# Altium project STB_LightBoard.PrjPcb (part 7 of 10)

## Sheet LED_Driver_NF2W757GT-F1.SchDoc: STB Light Board - 5000K
size A3; Author: mayerph; DrawnBy: mayerph; Organization: PBL; Revision: A; SheetNumber: 7; SheetTotal: 20
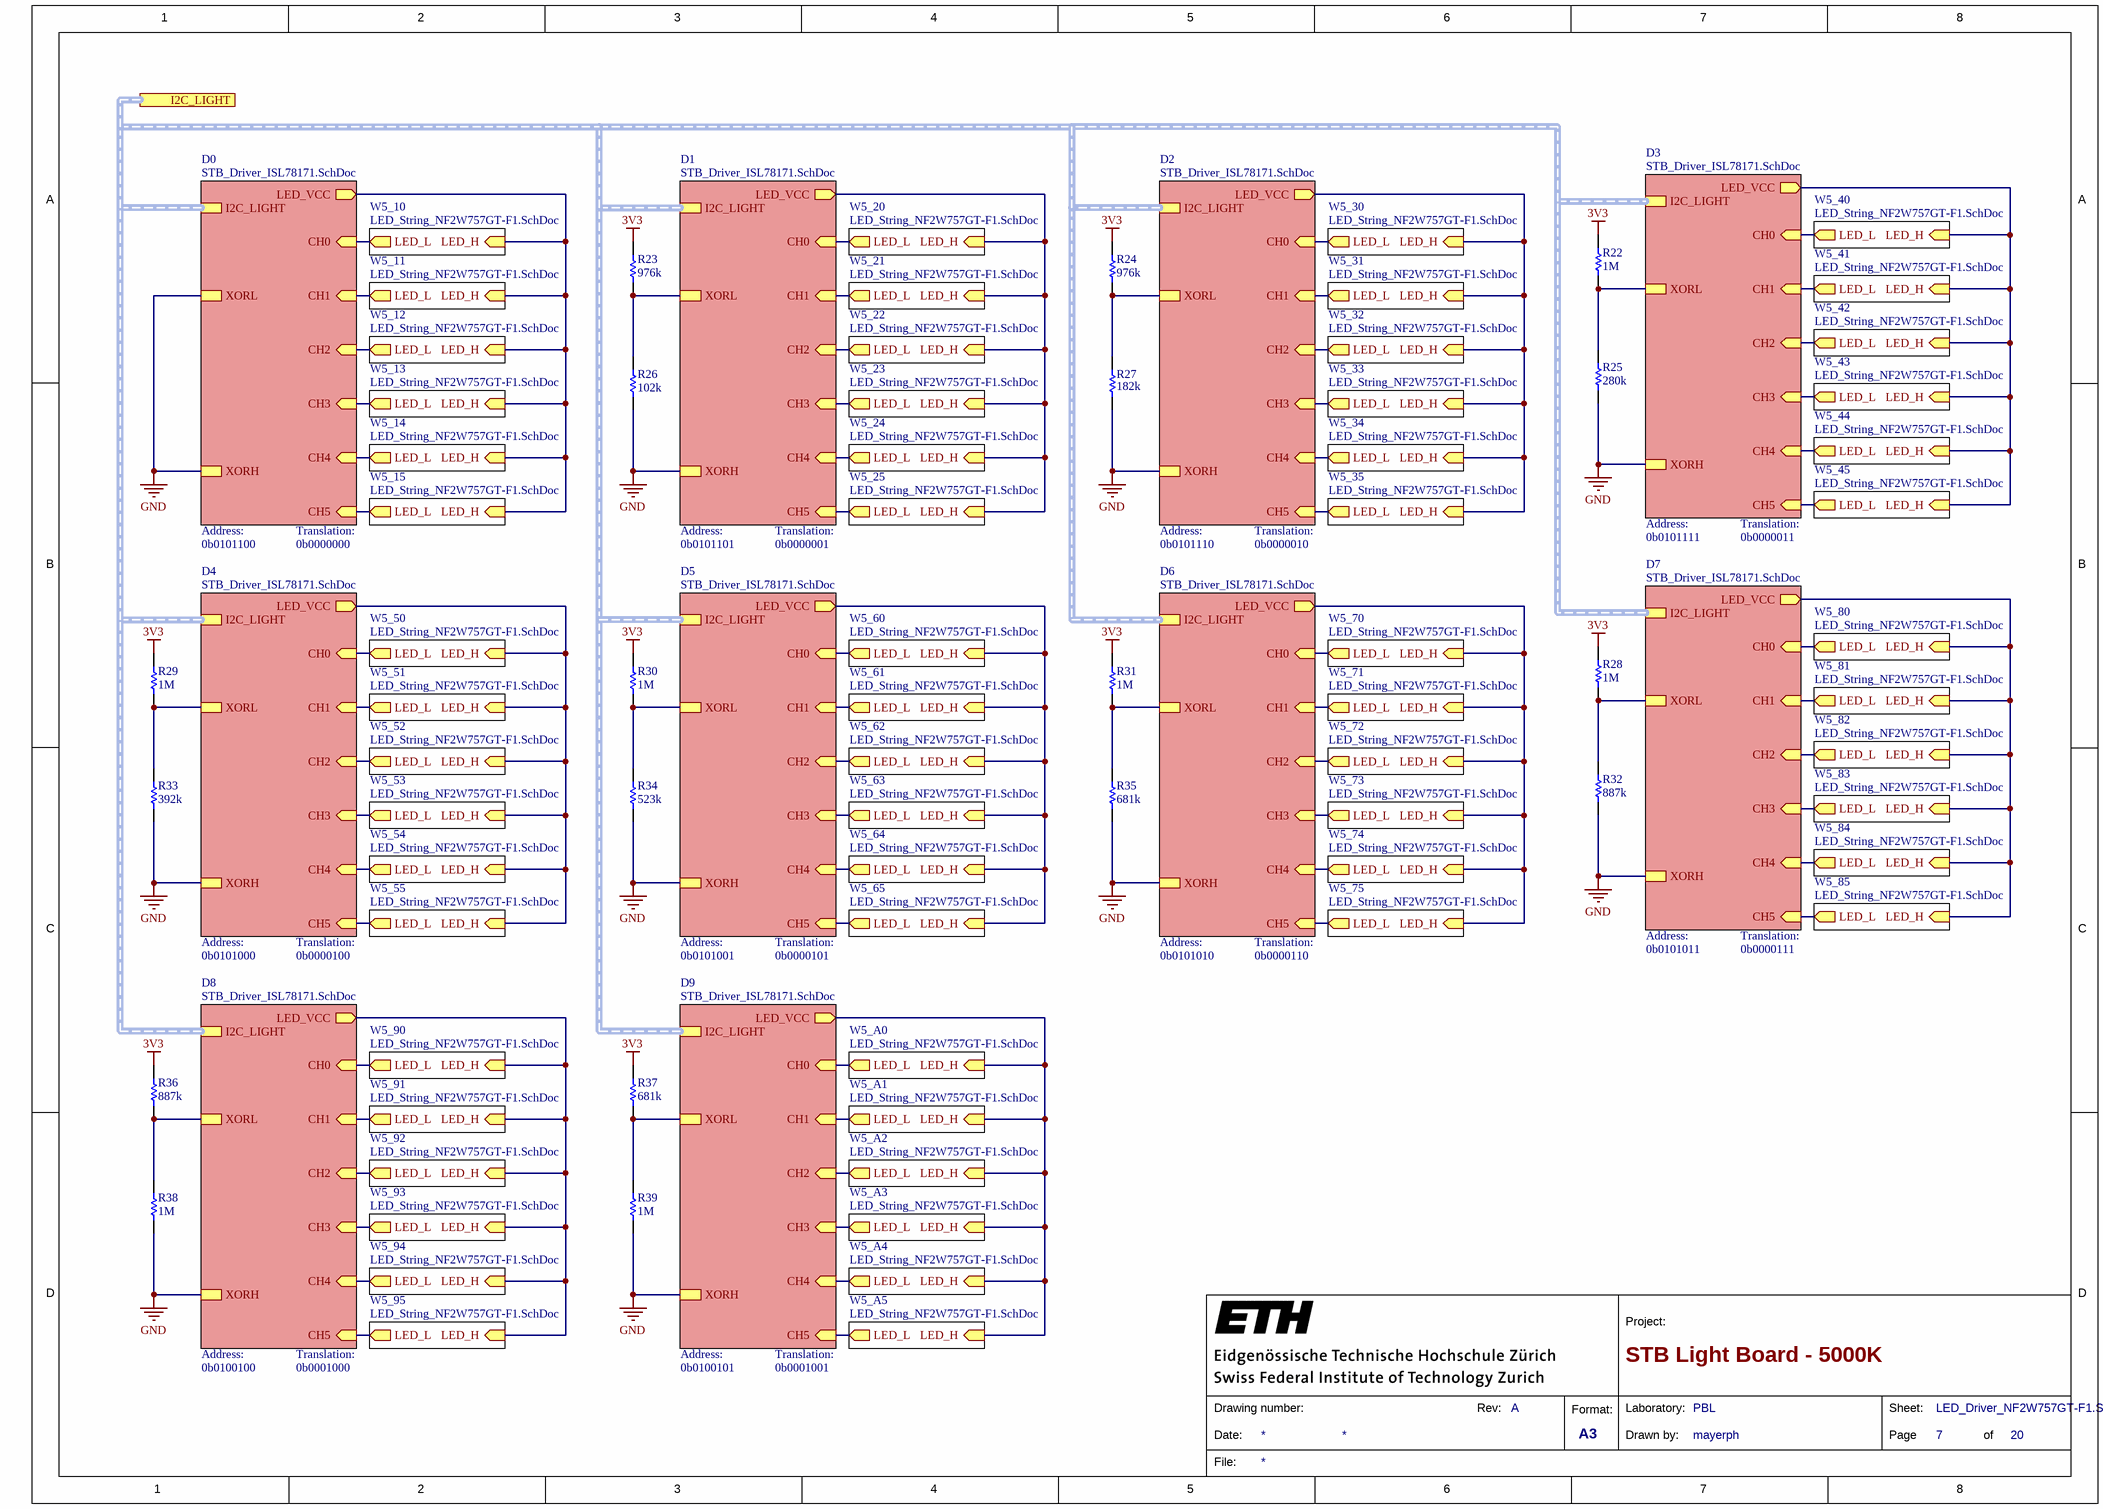
[diagram p14: LED_Driver_NF2W757GT-F1.SchDoc]

### Parts
R22  1M  [RESC1005X40X25LL05T05]
R23  976k  [RESC1005X40X25LL05T05]
R24  976k  [RESC1005X40X25LL05T05]
R25  280k  [RESC1005X40X25LL05T05]
R26  102k  [RESC1005X40X25LL05T05]
R27  182k  [RESC1005X40X25LL05T05]
R28  1M  [RESC1005X40X25LL05T05]
R29  1M  [RESC1005X40X25LL05T05]
R30  1M  [RESC1005X40X25LL05T05]
R31  1M  [RESC1005X40X25LL05T05]
R32  887k  [RESC1005X40X25LL05T10]
R33  392k  [RESC1005X40X25LL05T05]
R34  523k  [RESC1005X40X25LL05T05]
R35  681k  [RESC1005X40X25LL05T05]
R36  887k  [RESC1005X40X25LL05T10]
R37  681k  [RESC1005X40X25LL05T05]
R38  1M  [RESC1005X40X25LL05T05]
R39  1M  [RESC1005X40X25LL05T05]

### Sub-sheets
D0 = STB_Driver_ISL78171.SchDoc: CH0 (in), XORL, XORH, LED_VCC (out), CH1 (in), CH2 (in), CH3 (in), CH4 (in), CH5 (in), I2C_LIGHT (harness I2C_LIGHT)
D1 = STB_Driver_ISL78171.SchDoc: CH0 (in), XORL, XORH, LED_VCC (out), CH1 (in), CH2 (in), CH3 (in), CH4 (in), CH5 (in), I2C_LIGHT (harness I2C_LIGHT)
D2 = STB_Driver_ISL78171.SchDoc: CH0 (in), XORL, XORH, LED_VCC (out), CH1 (in), CH2 (in), CH3 (in), CH4 (in), CH5 (in), I2C_LIGHT (harness I2C_LIGHT)
D3 = STB_Driver_ISL78171.SchDoc: CH0 (in), XORL, XORH, LED_VCC (out), CH1 (in), CH2 (in), CH3 (in), CH4 (in), CH5 (in), I2C_LIGHT (harness I2C_LIGHT)
D4 = STB_Driver_ISL78171.SchDoc: CH0 (in), XORL, XORH, LED_VCC (out), CH1 (in), CH2 (in), CH3 (in), CH4 (in), CH5 (in), I2C_LIGHT (harness I2C_LIGHT)
D5 = STB_Driver_ISL78171.SchDoc: CH0 (in), XORL, XORH, LED_VCC (out), CH1 (in), CH2 (in), CH3 (in), CH4 (in), CH5 (in), I2C_LIGHT (harness I2C_LIGHT)
D6 = STB_Driver_ISL78171.SchDoc: CH0 (in), XORL, XORH, LED_VCC (out), CH1 (in), CH2 (in), CH3 (in), CH4 (in), CH5 (in), I2C_LIGHT (harness I2C_LIGHT)
D7 = STB_Driver_ISL78171.SchDoc: CH0 (in), XORL, XORH, LED_VCC (out), CH1 (in), CH2 (in), CH3 (in), CH4 (in), CH5 (in), I2C_LIGHT (harness I2C_LIGHT)
D8 = STB_Driver_ISL78171.SchDoc: CH0 (in), XORL, XORH, LED_VCC (out), CH1 (in), CH2 (in), CH3 (in), CH4 (in), CH5 (in), I2C_LIGHT (harness I2C_LIGHT)
D9 = STB_Driver_ISL78171.SchDoc: CH0 (in), XORL, XORH, LED_VCC (out), CH1 (in), CH2 (in), CH3 (in), CH4 (in), CH5 (in), I2C_LIGHT (harness I2C_LIGHT)
W5_10 = LED_String_NF2W757GT-F1.SchDoc: LED_H (in), LED_L (out)
W5_11 = LED_String_NF2W757GT-F1.SchDoc: LED_H (in), LED_L (out)
W5_12 = LED_String_NF2W757GT-F1.SchDoc: LED_H (in), LED_L (out)
W5_13 = LED_String_NF2W757GT-F1.SchDoc: LED_H (in), LED_L (out)
W5_14 = LED_String_NF2W757GT-F1.SchDoc: LED_H (in), LED_L (out)
W5_15 = LED_String_NF2W757GT-F1.SchDoc: LED_H (in), LED_L (out)
W5_20 = LED_String_NF2W757GT-F1.SchDoc: LED_H (in), LED_L (out)
W5_21 = LED_String_NF2W757GT-F1.SchDoc: LED_H (in), LED_L (out)
W5_22 = LED_String_NF2W757GT-F1.SchDoc: LED_H (in), LED_L (out)
W5_23 = LED_String_NF2W757GT-F1.SchDoc: LED_H (in), LED_L (out)
W5_24 = LED_String_NF2W757GT-F1.SchDoc: LED_H (in), LED_L (out)
W5_25 = LED_String_NF2W757GT-F1.SchDoc: LED_H (in), LED_L (out)
W5_30 = LED_String_NF2W757GT-F1.SchDoc: LED_H (in), LED_L (out)
W5_31 = LED_String_NF2W757GT-F1.SchDoc: LED_H (in), LED_L (out)
W5_32 = LED_String_NF2W757GT-F1.SchDoc: LED_H (in), LED_L (out)
W5_33 = LED_String_NF2W757GT-F1.SchDoc: LED_H (in), LED_L (out)
W5_34 = LED_String_NF2W757GT-F1.SchDoc: LED_H (in), LED_L (out)
W5_35 = LED_String_NF2W757GT-F1.SchDoc: LED_H (in), LED_L (out)
W5_40 = LED_String_NF2W757GT-F1.SchDoc: LED_H (in), LED_L (out)
W5_41 = LED_String_NF2W757GT-F1.SchDoc: LED_H (in), LED_L (out)
W5_42 = LED_String_NF2W757GT-F1.SchDoc: LED_H (in), LED_L (out)
W5_43 = LED_String_NF2W757GT-F1.SchDoc: LED_H (in), LED_L (out)
W5_44 = LED_String_NF2W757GT-F1.SchDoc: LED_H (in), LED_L (out)
W5_45 = LED_String_NF2W757GT-F1.SchDoc: LED_H (in), LED_L (out)
W5_50 = LED_String_NF2W757GT-F1.SchDoc: LED_H (in), LED_L (out)
W5_51 = LED_String_NF2W757GT-F1.SchDoc: LED_H (in), LED_L (out)
W5_52 = LED_String_NF2W757GT-F1.SchDoc: LED_H (in), LED_L (out)
W5_53 = LED_String_NF2W757GT-F1.SchDoc: LED_H (in), LED_L (out)
W5_54 = LED_String_NF2W757GT-F1.SchDoc: LED_H (in), LED_L (out)
W5_55 = LED_String_NF2W757GT-F1.SchDoc: LED_H (in), LED_L (out)
W5_60 = LED_String_NF2W757GT-F1.SchDoc: LED_H (in), LED_L (out)
W5_61 = LED_String_NF2W757GT-F1.SchDoc: LED_H (in), LED_L (out)
W5_62 = LED_String_NF2W757GT-F1.SchDoc: LED_H (in), LED_L (out)
W5_63 = LED_String_NF2W757GT-F1.SchDoc: LED_H (in), LED_L (out)
W5_64 = LED_String_NF2W757GT-F1.SchDoc: LED_H (in), LED_L (out)
W5_65 = LED_String_NF2W757GT-F1.SchDoc: LED_H (in), LED_L (out)
W5_70 = LED_String_NF2W757GT-F1.SchDoc: LED_H (in), LED_L (out)
W5_71 = LED_String_NF2W757GT-F1.SchDoc: LED_H (in), LED_L (out)
W5_72 = LED_String_NF2W757GT-F1.SchDoc: LED_H (in), LED_L (out)
W5_73 = LED_String_NF2W757GT-F1.SchDoc: LED_H (in), LED_L (out)
W5_74 = LED_String_NF2W757GT-F1.SchDoc: LED_H (in), LED_L (out)
W5_75 = LED_String_NF2W757GT-F1.SchDoc: LED_H (in), LED_L (out)
W5_80 = LED_String_NF2W757GT-F1.SchDoc: LED_H (in), LED_L (out)
W5_81 = LED_String_NF2W757GT-F1.SchDoc: LED_H (in), LED_L (out)
W5_82 = LED_String_NF2W757GT-F1.SchDoc: LED_H (in), LED_L (out)
W5_83 = LED_String_NF2W757GT-F1.SchDoc: LED_H (in), LED_L (out)
W5_84 = LED_String_NF2W757GT-F1.SchDoc: LED_H (in), LED_L (out)
W5_85 = LED_String_NF2W757GT-F1.SchDoc: LED_H (in), LED_L (out)
W5_90 = LED_String_NF2W757GT-F1.SchDoc: LED_H (in), LED_L (out)
W5_91 = LED_String_NF2W757GT-F1.SchDoc: LED_H (in), LED_L (out)
W5_92 = LED_String_NF2W757GT-F1.SchDoc: LED_H (in), LED_L (out)
W5_93 = LED_String_NF2W757GT-F1.SchDoc: LED_H (in), LED_L (out)
W5_94 = LED_String_NF2W757GT-F1.SchDoc: LED_H (in), LED_L (out)
W5_95 = LED_String_NF2W757GT-F1.SchDoc: LED_H (in), LED_L (out)
W5_A0 = LED_String_NF2W757GT-F1.SchDoc: LED_H (in), LED_L (out)
W5_A1 = LED_String_NF2W757GT-F1.SchDoc: LED_H (in), LED_L (out)
W5_A2 = LED_String_NF2W757GT-F1.SchDoc: LED_H (in), LED_L (out)
W5_A3 = LED_String_NF2W757GT-F1.SchDoc: LED_H (in), LED_L (out)
W5_A4 = LED_String_NF2W757GT-F1.SchDoc: LED_H (in), LED_L (out)
W5_A5 = LED_String_NF2W757GT-F1.SchDoc: LED_H (in), LED_L (out)

### Ports
I2C_LIGHT (harness I2C_LIGHT, see STB_LightBoard[3C], LED_Driver_AREM-80C0[1A], LED_Driver_AREM-90C0[1A], LED_Driver_NE2B757GT[2B], LED_Driver_NE2G757GT[2B], LED_Driver_NE2R757GT-P6[2B], LED_Driver_NF2L757GT-F1[1A], LED_Driver_QBHP686[1A], STB_Driver_ISL78171[1A], STB_FanControl[1A], STB_UID[1A])

### Nets
3V3: R22.2 R23.2 R24.2 R28.2 R29.2 R30.2 R31.2 R36.2 R37.2
GND: R25.1 R26.1 R27.1 R32.1 R33.1 R34.1 R35.1 R38.1 R39.1 ; sheet D0/XORL, sheet D0/XORH, sheet D1/XORH, sheet D2/XORH, sheet D3/XORH, sheet D5/XORH, sheet D6/XORH, sheet D7/XORH, sheet D4/XORH, sheet D9/XORH, sheet D8/XORH
NetC7_D0_2: sheet D0/LED_VCC, sheet W5_10/LED_H, sheet W5_11/LED_H, sheet W5_12/LED_H, sheet W5_13/LED_H, sheet W5_14/LED_H, sheet W5_15/LED_H
NetC7_D1_2: sheet D1/LED_VCC, sheet W5_20/LED_H, sheet W5_21/LED_H, sheet W5_22/LED_H, sheet W5_23/LED_H, sheet W5_24/LED_H, sheet W5_25/LED_H
NetC7_D2_2: sheet D2/LED_VCC, sheet W5_30/LED_H, sheet W5_31/LED_H, sheet W5_32/LED_H, sheet W5_33/LED_H, sheet W5_34/LED_H, sheet W5_35/LED_H
NetC7_D3_2: sheet D3/LED_VCC, sheet W5_40/LED_H, sheet W5_41/LED_H, sheet W5_42/LED_H, sheet W5_43/LED_H, sheet W5_44/LED_H, sheet W5_45/LED_H
NetC7_D4_2: sheet D4/LED_VCC, sheet W5_50/LED_H, sheet W5_51/LED_H, sheet W5_52/LED_H, sheet W5_53/LED_H, sheet W5_54/LED_H, sheet W5_55/LED_H
NetC7_D5_2: sheet D5/LED_VCC, sheet W5_60/LED_H, sheet W5_61/LED_H, sheet W5_62/LED_H, sheet W5_63/LED_H, sheet W5_64/LED_H, sheet W5_65/LED_H
NetC7_D6_2: sheet D6/LED_VCC, sheet W5_70/LED_H, sheet W5_71/LED_H, sheet W5_72/LED_H, sheet W5_73/LED_H, sheet W5_74/LED_H, sheet W5_75/LED_H
NetC7_D7_2: sheet D7/LED_VCC, sheet W5_80/LED_H, sheet W5_81/LED_H, sheet W5_82/LED_H, sheet W5_83/LED_H, sheet W5_84/LED_H, sheet W5_85/LED_H
NetC7_D8_2: sheet D8/LED_VCC, sheet W5_90/LED_H, sheet W5_91/LED_H, sheet W5_92/LED_H, sheet W5_93/LED_H, sheet W5_94/LED_H, sheet W5_95/LED_H
NetC7_D9_2: sheet D9/LED_VCC, sheet W5_A0/LED_H, sheet W5_A1/LED_H, sheet W5_A2/LED_H, sheet W5_A3/LED_H, sheet W5_A4/LED_H, sheet W5_A5/LED_H
NetLED77_W5_10_1: sheet D0/CH0, sheet W5_10/LED_L
NetLED77_W5_11_1: sheet D0/CH1, sheet W5_11/LED_L
NetLED77_W5_12_1: sheet D0/CH2, sheet W5_12/LED_L
NetLED77_W5_13_1: sheet D0/CH3, sheet W5_13/LED_L
NetLED77_W5_14_1: sheet D0/CH4, sheet W5_14/LED_L
NetLED77_W5_15_1: sheet D0/CH5, sheet W5_15/LED_L
NetLED77_W5_20_1: sheet D1/CH0, sheet W5_20/LED_L
NetLED77_W5_21_1: sheet D1/CH1, sheet W5_21/LED_L
NetLED77_W5_22_1: sheet D1/CH2, sheet W5_22/LED_L
NetLED77_W5_23_1: sheet D1/CH3, sheet W5_23/LED_L
NetLED77_W5_24_1: sheet D1/CH4, sheet W5_24/LED_L
NetLED77_W5_25_1: sheet D1/CH5, sheet W5_25/LED_L
NetLED77_W5_30_1: sheet D2/CH0, sheet W5_30/LED_L
NetLED77_W5_31_1: sheet D2/CH1, sheet W5_31/LED_L
NetLED77_W5_32_1: sheet D2/CH2, sheet W5_32/LED_L
NetLED77_W5_33_1: sheet D2/CH3, sheet W5_33/LED_L
NetLED77_W5_34_1: sheet D2/CH4, sheet W5_34/LED_L
NetLED77_W5_35_1: sheet D2/CH5, sheet W5_35/LED_L
NetLED77_W5_40_1: sheet D3/CH0, sheet W5_40/LED_L
NetLED77_W5_41_1: sheet D3/CH1, sheet W5_41/LED_L
NetLED77_W5_42_1: sheet D3/CH2, sheet W5_42/LED_L
NetLED77_W5_43_1: sheet D3/CH3, sheet W5_43/LED_L
NetLED77_W5_44_1: sheet D3/CH4, sheet W5_44/LED_L
NetLED77_W5_45_1: sheet D3/CH5, sheet W5_45/LED_L
NetLED77_W5_50_1: sheet D4/CH0, sheet W5_50/LED_L
NetLED77_W5_51_1: sheet D4/CH1, sheet W5_51/LED_L
NetLED77_W5_52_1: sheet D4/CH2, sheet W5_52/LED_L
NetLED77_W5_53_1: sheet D4/CH3, sheet W5_53/LED_L
NetLED77_W5_54_1: sheet D4/CH4, sheet W5_54/LED_L
NetLED77_W5_55_1: sheet D4/CH5, sheet W5_55/LED_L
NetLED77_W5_60_1: sheet D5/CH0, sheet W5_60/LED_L
NetLED77_W5_61_1: sheet D5/CH1, sheet W5_61/LED_L
NetLED77_W5_62_1: sheet D5/CH2, sheet W5_62/LED_L
NetLED77_W5_63_1: sheet D5/CH3, sheet W5_63/LED_L
NetLED77_W5_64_1: sheet D5/CH4, sheet W5_64/LED_L
NetLED77_W5_65_1: sheet D5/CH5, sheet W5_65/LED_L
NetLED77_W5_70_1: sheet D6/CH0, sheet W5_70/LED_L
NetLED77_W5_71_1: sheet D6/CH1, sheet W5_71/LED_L
NetLED77_W5_72_1: sheet D6/CH2, sheet W5_72/LED_L
NetLED77_W5_73_1: sheet D6/CH3, sheet W5_73/LED_L
NetLED77_W5_74_1: sheet D6/CH4, sheet W5_74/LED_L
NetLED77_W5_75_1: sheet D6/CH5, sheet W5_75/LED_L
NetLED77_W5_80_1: sheet D7/CH0, sheet W5_80/LED_L
NetLED77_W5_81_1: sheet D7/CH1, sheet W5_81/LED_L
NetLED77_W5_82_1: sheet D7/CH2, sheet W5_82/LED_L
NetLED77_W5_83_1: sheet D7/CH3, sheet W5_83/LED_L
NetLED77_W5_84_1: sheet D7/CH4, sheet W5_84/LED_L
NetLED77_W5_85_1: sheet D7/CH5, sheet W5_85/LED_L
NetLED77_W5_90_1: sheet D8/CH0, sheet W5_90/LED_L
NetLED77_W5_91_1: sheet D8/CH1, sheet W5_91/LED_L
NetLED77_W5_92_1: sheet D8/CH2, sheet W5_92/LED_L
NetLED77_W5_93_1: sheet D8/CH3, sheet W5_93/LED_L
NetLED77_W5_94_1: sheet D8/CH4, sheet W5_94/LED_L
NetLED77_W5_95_1: sheet D8/CH5, sheet W5_95/LED_L
NetLED77_W5_A0_1: sheet D9/CH0, sheet W5_A0/LED_L
NetLED77_W5_A1_1: sheet D9/CH1, sheet W5_A1/LED_L
NetLED77_W5_A2_1: sheet D9/CH2, sheet W5_A2/LED_L
NetLED77_W5_A3_1: sheet D9/CH3, sheet W5_A3/LED_L
NetLED77_W5_A4_1: sheet D9/CH4, sheet W5_A4/LED_L
NetLED77_W5_A5_1: sheet D9/CH5, sheet W5_A5/LED_L
NetR22_1: R22.1 R25.2 ; sheet D3/XORL
NetR23_1: R23.1 R26.2 ; sheet D1/XORL
NetR24_1: R24.1 R27.2 ; sheet D2/XORL
NetR28_1: R28.1 R32.2 ; sheet D7/XORL
NetR29_1: R29.1 R33.2 ; sheet D4/XORL
NetR30_1: R30.1 R34.2 ; sheet D5/XORL
NetR31_1: R31.1 R35.2 ; sheet D6/XORL
NetR36_1: R36.1 R38.2 ; sheet D8/XORL
NetR37_1: R37.1 R39.2 ; sheet D9/XORL

### Buses and harness runs
harness port I2C_LIGHT = sheet D0/I2C_LIGHT = sheet D1/I2C_LIGHT = sheet D2/I2C_LIGHT = sheet D3/I2C_LIGHT = sheet D4/I2C_LIGHT = sheet D5/I2C_LIGHT = sheet D6/I2C_LIGHT = sheet D7/I2C_LIGHT = sheet D8/I2C_LIGHT = sheet D9/I2C_LIGHT

### Notes on the sheet
- 0b0101100
- Address:
- 0b0000000
- Translation:
- 0b0101101
- 0b0000001
- 0b0101110
- 0b0000010
- 0b0101111
- 0b0000011
- 0b0101000
- 0b0000100
- 0b0101001
- 0b0000101
- 0b0101010
- 0b0000110
- 0b0101011
- 0b0000111
- 0b0100100
- 0b0001000
- 0b0100101
- 0b0001001
- 1
- 2
- 3
- 4
- 5
- 6
- 7
- 8
- A
- B
- C
- D
- Project:
- Date:
- Drawing number:
- Rev:
- Format:
- A3
- Drawn by:
- Laboratory:
- Page
- Sheet:
- of
- File:

### Library data of the parts
R22 R28-R31 R38 R39 = CMP-2002-00609-3: Chip Resistor, 1 MOhm, +/- 1%, 100 mW, -55 to 155 degC, 0402 (1005 Metric), RoHS, Tape and Reel; PartNumber: ERJ-2RKF1004X; Manufacturer: Basic Passives; Voltage Rating: 50 V; Case\/Package: 0402; Value: 1 MOhm; Power Rating: 100 mW; Rated Power Dissipation (P): 100mW; Temperature Coefficient: 100ppm/°C; Working Voltage: 50V; Rated Temperature: 70°C; Package Height: 0.35mm; Package Length: 1mm; Package Width: 0.5mm; Reference Standard: AEC-Q200; Pins: 2; Max Operating Temperature: 155 degC; ComponentLink2URL: http://industrial.panasonic.com/cdbs/www-data/pdf/RDA0000/AOA0000C86.pdf; Weight: 2.8E-05oz; ComponentLink1URL: http://www.panasonic.com/; Radiation Hardening: No; Height: 0.35 mm; Case Code (Imperial): 0402; ComponentLink2Description: Datasheet; Mount: Surface Mount; ComponentLink1Description: Manufacturer URL; REACH SVHC: Yes; Length: 1 mm; Min Operating Temperature: -55 degC; Width: 0.5 mm; Package Quantity: 10000; Tolerance: 1%; PackageDescription: 2-Pin Surface Mount Device, Body 1 x 0.5 mm; RoHSCompliant: true; DatasheetVersion: 04/2015; PackageReference: 0402; Mounting Technology: Surface Mount; Case Code (Metric): 1005; Packaging: Tape and Reel; Supplier 1: Digi-Key; Supplier Part Number 1: P1.00MLDKR-ND; Manufacturer Part Number: ERJ-2RKF1004X; RoHS: Yes; Category: Chip SMD Resistors; Stock 1: 1012879; Pricing 1: 1=0.10000, 10=0.03300, 100=0.01330, 1000=0.00599, 2500=0.00520, 5000=0.00429 (USD); Number of Pins: 2; Package Shape: Rectangular; Size Code: 0402; Terminal Finish: Nickel; JESD-609 Code: e3; Resistor Type: FIXED RESISTOR; Construction: Rectangular; Package Style: SMTMeter; Technology: METAL GLAZE/THICK FILM; Termination: Wraparound; Reach SVHC Compliant: Yes; RoHS Compliant: Yes; ComponentLink3URL: https://datasheet.ciiva.com:443/pdfs/VipMasterIC/IC/PANA/PANA-S-A0009889626/PANA-S-A0009889626-1.pdf?src-supplier=IHS+Markit; ComponentLink3Description: https://datasheet.ciiva.com:443/pdfs/VipMasterIC/IC/PANA/PANA-S-A0009889626/PANA-S-A0009889626-1.pdf?src-supplier=IHS+Markit; ComponentLink4URL: https://datasheet.ciiva.com/34303/1987046-34303551.pdf?src-supplier=Jameco; ComponentLink4Description: https://datasheet.ciiva.com/34303/1987046-34303551.pdf?src-supplier=Jameco; ComponentLink5URL: https://datasheet.ciiva.com/11821/0900766b80f80784-11821229.pdf?src-supplier=RSComponents; ComponentLink5Description: https://datasheet.ciiva.com/11821/0900766b80f80784-11821229.pdf?src-supplier=RSComponents; ComponentLink6URL: https://datasheet.ciiva.com/7909/aoa0000ce2-7909180.pdf?src-supplier=Element14; ComponentLink6Description: https://datasheet.ciiva.com/7909/aoa0000ce2-7909180.pdf?src-supplier=Element14; ComponentLink7URL: https://datasheet.ciiva.com/22723/1678782-22723164.pdf?src-supplier=Element14; ComponentLink7Description: https://datasheet.ciiva.com/22723/1678782-22723164.pdf?src-supplier=Element14; ComponentLink8URL: https://datasheet.ciiva.com/24158/aoa0000ce2-24158990.pdf?src-supplier=Mouser; ComponentLink8Description: https://datasheet.ciiva.com/24158/aoa0000ce2-24158990.pdf?src-supplier=Mouser; ComponentLink9URL: https://datasheet.ciiva.com/16766/70260748-16766711.pdf?src-supplier=Allied+Electronics; ComponentLink9Description: https://datasheet.ciiva.com/16766/70260748-16766711.pdf?src-supplier=Allied+Electronics; ComponentLink10URL: https://datasheet.ciiva.com/16779/70260748-16779288.pdf?src-supplier=Allied+Electronics; ComponentLink10Description: https://datasheet.ciiva.com/16779/70260748-16779288.pdf?src-supplier=Allied+Electronics; ComponentLink11URL: https://datasheet.ciiva.com/16199/aoa0000ce2-16199544.pdf?src-supplier=Future+Electronics; ComponentLink11Description: https://datasheet.ciiva.com/16199/aoa0000ce2-16199544.pdf?src-supplier=Future+Electronics
R23 R24 = CMP-2002-01120-1: Manufacturer: Panasonic; Part Number: ERJ-2RKF9763X; Tolerance: 1%; Rated Power Dissipation (P): 100mW; Rated Temperature: 70°C; Value: 976 kOhm; Temperature Coefficient: 100ppm/°C; Working Voltage: 50V; Package Height: 0.35mm; Package Length: 1mm; Package Width: 0.5mm; Reference Standard: AEC-Q200; Supplier 1: Digi-Key; Supplier Part Number 1: P976KLCT-ND; Manufacturer Part Number: ERJ-2RKF9763X; RoHS: Yes; Category: Chip SMD Resistors; Stock 1: 136638; Pricing 1: 1=0.10000, 10=0.03300, 100=0.01330, 1000=0.00599, 2500=0.00520, 5000=0.00429 (USD); Mount: Surface Mount; Number of Pins: 2; Size Code: 0402; Terminal Finish: Nickel; Package Shape: Rectangular; Min Operating Temperature: -55°C; Max Operating Temperature: 155°C; Resistor Type: FIXED RESISTOR; Construction: Rectangular; Package Style: SMTMeter; Packaging: Tape and Reel; Termination: Wraparound; JESD-609 Code: e3; Technology: METAL GLAZE/THICK FILM; Reach SVHC Compliant: Yes; RoHS Compliant: Yes; ComponentLink1URL: https://datasheet.ciiva.com:443/pdfs/VipMasterIC/IC/PANA/PANA-S-A0009889626/PANA-S-A0009889626-1.pdf?src-supplier=IHS+Markit; ComponentLink1Description: https://datasheet.ciiva.com:443/pdfs/VipMasterIC/IC/PANA/PANA-S-A0009889626/PANA-S-A0009889626-1.pdf?src-supplier=IHS+Markit; ComponentLink2URL: https://datasheet.ciiva.com/43467/1678782-43467581.pdf?src-supplier=Farnell; ComponentLink2Description: https://datasheet.ciiva.com/43467/1678782-43467581.pdf?src-supplier=Farnell; ComponentLink3URL: https://datasheet.ciiva.com/46372/1678782-46372911.pdf?src-supplier=Element14; ComponentLink3Description: https://datasheet.ciiva.com/46372/1678782-46372911.pdf?src-supplier=Element14; ComponentLink4URL: https://datasheet.ciiva.com/22668/1678782-22668415.pdf?src-supplier=Element14; ComponentLink4Description: https://datasheet.ciiva.com/22668/1678782-22668415.pdf?src-supplier=Element14; ComponentLink5URL: https://datasheet.ciiva.com/16758/70260748-16758903.pdf?src-supplier=Allied+Electronics; ComponentLink5Description: https://datasheet.ciiva.com/16758/70260748-16758903.pdf?src-supplier=Allied+Electronics; ComponentLink6URL: https://datasheet.ciiva.com/9179/aoa0000ce2-9179357.pdf?src-supplier=Avnet; ComponentLink6Description: https://datasheet.ciiva.com/9179/aoa0000ce2-9179357.pdf?src-supplier=Avnet; ComponentLink7URL: https://datasheet.ciiva.com/30176/aoa0000ce2-30176831.pdf?src-supplier=Onlinecomponents.com; ComponentLink7Description: https://datasheet.ciiva.com/30176/aoa0000ce2-30176831.pdf?src-supplier=Onlinecomponents.com
R25 = CMP-1011-00785-4: Chip Resistor, 280 KOhm, +/- 1%, 100 mW, -55 to 155 degC, 0402 (1005 Metric), RoHS, Cut Tape; PartNumber: ERJ-2RKF2803X; Manufacturer: Basic Passives; Power Rating: 100 mW; Case\/Package: 0402; Voltage Rating: 50 V; Rated Power Dissipation (P): 100mW; Rated Temperature: 70°C; Temperature Coefficient: 100ppm/°C; Working Voltage: 50V; Package Height: 0.35mm; Package Length: 1mm; Package Width: 0.5mm; Reference Standard: AEC-Q200; Value: 280 kOhm; Width: 0.02 inch; Packaging: Cut Tape; Min Operating Temperature: -55 degC; Package Quantity: 10000; Height: 0.016 inch; ComponentLink2Description: Datasheet; REACH SVHC: Yes; Length: 0.039 inch; Mounting Technology: Surface Mount; Mount: Surface Mount; ComponentLink1Description: Manufacturer URL; PackageDescription: 2-Pin Surface Mount Device, Body 1 x 0.5 mm; PackageReference: 0402; Case Code (Metric): 1005; ComponentLink2URL: http://industrial.panasonic.com/cdbs/www-data/pdf/RDA0000/AOA0000C86.pdf; Pins: 2; DatasheetVersion: 04/2015; ComponentLink1URL: http://www.panasonic.com/; RoHSCompliant: true; Case Code (Imperial): 0402; Tolerance: 1%; Max Operating Temperature: 155 degC; Supplier 1: Digi-Key; Supplier Part Number 1: P280KLDKR-ND; Manufacturer Part Number: ERJ-2RKF2803X; RoHS: Yes; Category: Chip SMD Resistors; Stock 1: 156859; Pricing 1: 1=0.10000, 10=0.03300, 100=0.01330, 1000=0.00599, 2500=0.00520, 5000=0.00429 (USD); Number of Pins: 2; Size Code: 0402; Terminal Finish: Nickel; Package Shape: Rectangular; Resistor Type: FIXED RESISTOR; Termination: Wraparound; JESD-609 Code: e3; Construction: Rectangular; Package Style: SMTMeter; Technology: METAL GLAZE/THICK FILM; Reach SVHC Compliant: Yes; RoHS Compliant: Yes; ComponentLink3URL: https://datasheet.ciiva.com:443/pdfs/VipMasterIC/IC/PANA/PANA-S-A0009889626/PANA-S-A0009889626-1.pdf?src-supplier=IHS+Markit; ComponentLink3Description: https://datasheet.ciiva.com:443/pdfs/VipMasterIC/IC/PANA/PANA-S-A0009889626/PANA-S-A0009889626-1.pdf?src-supplier=IHS+Markit; ComponentLink4URL: https://datasheet.ciiva.com/9183/aoa0000ce2-9183500.pdf?src-supplier=Avnet; ComponentLink4Description: https://datasheet.ciiva.com/9183/aoa0000ce2-9183500.pdf?src-supplier=Avnet; ComponentLink5URL: https://datasheet.ciiva.com/28594/1694929-28594570.pdf?src-supplier=Element14; ComponentLink5Description: https://datasheet.ciiva.com/28594/1694929-28594570.pdf?src-supplier=Element14; ComponentLink6URL: https://datasheet.ciiva.com/24024/aoa0000ce2-24024731.pdf?src-supplier=Mouser; ComponentLink6Description: https://datasheet.ciiva.com/24024/aoa0000ce2-24024731.pdf?src-supplier=Mouser; ComponentLink7URL: https://datasheet.ciiva.com/30177/aoa0000ce2-30177532.pdf?src-supplier=Onlinecomponents.com; ComponentLink7Description: https://datasheet.ciiva.com/30177/aoa0000ce2-30177532.pdf?src-supplier=Onlinecomponents.com; ComponentLink8URL: https://datasheet.ciiva.com/7712/1678782-7712815.pdf?src-supplier=Element14; ComponentLink8Description: https://datasheet.ciiva.com/7712/1678782-7712815.pdf?src-supplier=Element14
R26 = CMP-2002-00613-1: Manufacturer: Panasonic; Part Number: ERJ-2RKF1023X; Tolerance: 1%; Rated Power Dissipation (P): 100mW; Rated Temperature: 70°C; Value: 102 kOhm; Temperature Coefficient: 100ppm/°C; Working Voltage: 50V; Package Height: 0.35mm; Package Length: 1mm; Package Width: 0.5mm; Reference Standard: AEC-Q200; Supplier 1: Digi-Key; Supplier Part Number 1: P102KLDKR-ND; Manufacturer Part Number: ERJ-2RKF1023X; RoHS: Yes; Category: Chip SMD Resistors; Stock 1: 79400; Pricing 1: 1=0.10000, 10=0.03300, 100=0.01330, 1000=0.00599, 2500=0.00520, 5000=0.00429 (USD); Mount: Surface Mount; Number of Pins: 2; Size Code: 0402; Terminal Finish: Nickel; Package Shape: Rectangular; Min Operating Temperature: -55°C; Max Operating Temperature: 155°C; Resistor Type: FIXED RESISTOR; Construction: Rectangular; Package Style: SMTMeter; Packaging: Tape and Reel; Technology: METAL GLAZE/THICK FILM; Termination: Wraparound; JESD-609 Code: e3; Reach SVHC Compliant: Yes; RoHS Compliant: Yes; ComponentLink1URL: https://datasheet.ciiva.com:443/pdfs/VipMasterIC/IC/PANA/PANA-S-A0009889626/PANA-S-A0009889626-1.pdf?src-supplier=IHS+Markit; ComponentLink1Description: https://datasheet.ciiva.com:443/pdfs/VipMasterIC/IC/PANA/PANA-S-A0009889626/PANA-S-A0009889626-1.pdf?src-supplier=IHS+Markit; ComponentLink2URL: https://datasheet.ciiva.com/43467/1678782-43467481.pdf?src-supplier=Farnell; ComponentLink2Description: https://datasheet.ciiva.com/43467/1678782-43467481.pdf?src-supplier=Farnell; ComponentLink3URL: https://datasheet.ciiva.com/9119/aoa0000ce2-9119242.pdf?src-supplier=Avnet; ComponentLink3Description: https://datasheet.ciiva.com/9119/aoa0000ce2-9119242.pdf?src-supplier=Avnet; ComponentLink4URL: https://datasheet.ciiva.com/16781/70260748-16781503.pdf?src-supplier=Allied+Electronics; ComponentLink4Description: https://datasheet.ciiva.com/16781/70260748-16781503.pdf?src-supplier=Allied+Electronics; ComponentLink5URL: https://datasheet.ciiva.com/22673/1678782-22673487.pdf?src-supplier=Element14; ComponentLink5Description: https://datasheet.ciiva.com/22673/1678782-22673487.pdf?src-supplier=Element14; ComponentLink6URL: https://datasheet.ciiva.com/16763/70260748-16763080.pdf?src-supplier=Allied+Electronics; ComponentLink6Description: https://datasheet.ciiva.com/16763/70260748-16763080.pdf?src-supplier=Allied+Electronics; ComponentLink7URL: https://datasheet.ciiva.com/7712/1678782-7712798.pdf?src-supplier=Element14; ComponentLink7Description: https://datasheet.ciiva.com/7712/1678782-7712798.pdf?src-supplier=Element14; ComponentLink8URL: https://datasheet.ciiva.com/46373/1678782-46373215.pdf?src-supplier=Element14; ComponentLink8Description: https://datasheet.ciiva.com/46373/1678782-46373215.pdf?src-supplier=Element14
R27 = CMP-2002-08256-1: Manufacturer: Vishay Dale; Part Number: CRCW0402182KFKED; Value: 182 kOhm; Tolerance: 1%; Rated Power Dissipation (P): 63mW; Resistance: 182kR; Temperature Coefficient: 100ppm/°C; Working Voltage: 50V; Rated Temperature: 70°C; Package Height: 0.35mm; Package Length: 1mm; Package Width: 0.5mm; Reference Standard: AEC-Q200; Supplier 1: Digi-Key; Supplier Part Number 1: 541-182KLDKR-ND; Manufacturer Part Number: CRCW0402182KFKED; RoHS: Yes; Category: Chip SMD Resistors; Stock 1: 76709; Pricing 1: 1=0.10000, 10=0.03600, 100=0.01460, 1000=0.00656, 2500=0.00569, 5000=0.00470 (USD); Mount: Surface Mount; Number of Pins: 2; Size Code: 0402; Terminal Finish: Nickel; Package Shape: Rectangular; Min Operating Temperature: -55°C; Max Operating Temperature: 155°C; JESD-609 Code: e3; Resistor Type: FIXED RESISTOR; Construction: Chip; Package Style: SMTMeter; Packaging: Tape and Reel; Technology: METAL GLAZE/THICK FILM; Termination: Wraparound; Reach SVHC Compliant: Yes; RoHS Compliant: Yes; ComponentLink1URL: https://datasheet.ciiva.com:443/pdfs/VipMasterIC/IC/VISH/VISH-S-A0007266705/VISH-S-A0007266705-1.pdf?src-supplier=IHS+Markit; ComponentLink1Description: https://datasheet.ciiva.com:443/pdfs/VipMasterIC/IC/VISH/VISH-S-A0007266705/VISH-S-A0007266705-1.pdf?src-supplier=IHS+Markit; ComponentLink2URL: https://datasheet.ciiva.com/3256/dcrcwe3-3256117.pdf?src-supplier=Avnet; ComponentLink2Description: https://datasheet.ciiva.com/3256/dcrcwe3-3256117.pdf?src-supplier=Avnet; ComponentLink3URL: https://datasheet.ciiva.com/2463/dcrcwe3-2463286.pdf?src-supplier=Digi-Key; ComponentLink3Description: https://datasheet.ciiva.com/2463/dcrcwe3-2463286.pdf?src-supplier=Digi-Key; ComponentLink4URL: https://datasheet.ciiva.com/5545/dcrcwe3-109170-5545910.pdf?src-supplier=Mouser; ComponentLink4Description: https://datasheet.ciiva.com/5545/dcrcwe3-109170-5545910.pdf?src-supplier=Mouser; ComponentLink5URL: https://datasheet.ciiva.com/2463/dcrcwe3-2463287.pdf?src-supplier=Digi-Key; ComponentLink5Description: https://datasheet.ciiva.com/2463/dcrcwe3-2463287.pdf?src-supplier=Digi-Key; ComponentLink6URL: https://datasheet.ciiva.com/7714/1697337-7714183.pdf?src-supplier=Element14; ComponentLink6Description: https://datasheet.ciiva.com/7714/1697337-7714183.pdf?src-supplier=Element14; ComponentLink7URL: https://datasheet.ciiva.com/2463/dcrcwe3-2463288.pdf?src-supplier=Digi-Key; ComponentLink7Description: https://datasheet.ciiva.com/2463/dcrcwe3-2463288.pdf?src-supplier=Digi-Key; ComponentLink8URL: https://datasheet.ciiva.com/16785/70201119-16785993.pdf?src-supplier=Allied+Electronics; ComponentLink8Description: https://datasheet.ciiva.com/16785/70201119-16785993.pdf?src-supplier=Allied+Electronics; ComponentLink9URL: https://datasheet.ciiva.com/7714/1697337-7714365.pdf?src-supplier=Element14; ComponentLink9Description: https://datasheet.ciiva.com/7714/1697337-7714365.pdf?src-supplier=Element14
R32 R36 = CMP-2002-07827-1: Part Number: RC0402FR-07887KL; Manufacturer: Yageo / Phycomp; Tolerance: 1%; Rated Power Dissipation (P): 62.5mW; Rated Temperature: 70°C; Value: 887 kOhm; Temperature Coefficient: 100ppm/°C; Working Voltage: 50V; Additional Feature: LASER TRIMMABLE; Package Height: 0.35mm; Package Length: 1mm; Package Width: 0.5mm; Supplier 1: Digi-Key; Supplier Part Number 1: YAG3251CT-ND; Manufacturer Part Number: RC0402FR-07887KL; RoHS: Yes; Category: Chip SMD Resistors; Stock 1: 288491; Pricing 1: 1=0.10000, 10=0.01500, 100=0.00600, 1000=0.00267, 2500=0.00232, 5000=0.00192 (USD); Mount: Surface Mount; Number of Pins: 2; Size Code: 0402; Terminal Finish: Nickel; Package Shape: Rectangular; Min Operating Temperature: -55°C; Max Operating Temperature: 155°C; Resistor Type: FIXED RESISTOR; Construction: Chip; Package Style: SMTMeter; Packaging: Tape and Reel; Termination: Wraparound; JESD-609 Code: e3; Technology: METAL GLAZE/THICK FILM; Reach SVHC Compliant: Yes; RoHS Compliant: Yes; ComponentLink1URL: https://datasheet.ciiva.com:443/pdfs/VipMasterIC/IC/YAGO/YAGO-S-A0008145938/YAGO-S-A0008145938-1.pdf?src-supplier=IHS+Markit; ComponentLink1Description: https://datasheet.ciiva.com:443/pdfs/VipMasterIC/IC/YAGO/YAGO-S-A0008145938/YAGO-S-A0008145938-1.pdf?src-supplier=IHS+Markit; ComponentLink2URL: https://datasheet.ciiva.com/16744/pyu-rc0402-51-rohs-l-6-r-16744239.pdf?src-supplier=Future+Electronics; ComponentLink2Description: https://datasheet.ciiva.com/16744/pyu-rc0402-51-rohs-l-6-r-16744239.pdf?src-supplier=Future+Electronics
R33 = CMP-2002-00914-1: Part Number: ERJ-2RKF3923X; Manufacturer: Panasonic; Tolerance: 1%; Rated Power Dissipation (P): 100mW; Rated Temperature: 70°C; Value: 392 kOhm; Temperature Coefficient: 100ppm/°C; Working Voltage: 50V; Package Height: 0.35mm; Package Length: 1mm; Package Width: 0.5mm; Reference Standard: AEC-Q200; Supplier 1: Digi-Key; Supplier Part Number 1: P392KLDKR-ND; Manufacturer Part Number: ERJ-2RKF3923X; RoHS: Yes; Category: Chip SMD Resistors; Stock 1: 100496; Pricing 1: 1=0.10000, 10=0.03300, 100=0.01330, 1000=0.00599, 2500=0.00520, 5000=0.00429 (USD); Mount: Surface Mount; Number of Pins: 2; Size Code: 0402; Terminal Finish: Nickel; Package Shape: Rectangular; Min Operating Temperature: -55°C; Max Operating Temperature: 155°C; JESD-609 Code: e3; Resistor Type: FIXED RESISTOR; Construction: Rectangular; Package Style: SMTMeter; Packaging: Tape and Reel; Technology: METAL GLAZE/THICK FILM; Termination: Wraparound; Reach SVHC Compliant: Yes; RoHS Compliant: Yes; ComponentLink1URL: https://datasheet.ciiva.com:443/pdfs/VipMasterIC/IC/PANA/PANA-S-A0009889626/PANA-S-A0009889626-1.pdf?src-supplier=IHS+Markit; ComponentLink1Description: https://datasheet.ciiva.com:443/pdfs/VipMasterIC/IC/PANA/PANA-S-A0009889626/PANA-S-A0009889626-1.pdf?src-supplier=IHS+Markit; ComponentLink2URL: https://datasheet.ciiva.com/24069/aoa0000ce2-24069223.pdf?src-supplier=Mouser; ComponentLink2Description: https://datasheet.ciiva.com/24069/aoa0000ce2-24069223.pdf?src-supplier=Mouser; ComponentLink3URL: https://datasheet.ciiva.com/30085/aoa0000ce2-30085781.pdf?src-supplier=Onlinecomponents.com; ComponentLink3Description: https://datasheet.ciiva.com/30085/aoa0000ce2-30085781.pdf?src-supplier=Onlinecomponents.com; ComponentLink4URL: https://datasheet.ciiva.com/16781/70260748-16781463.pdf?src-supplier=Allied+Electronics; ComponentLink4Description: https://datasheet.ciiva.com/16781/70260748-16781463.pdf?src-supplier=Allied+Electronics; ComponentLink5URL: https://datasheet.ciiva.com/22673/1678782-22673356.pdf?src-supplier=Element14; ComponentLink5Description: https://datasheet.ciiva.com/22673/1678782-22673356.pdf?src-supplier=Element14; ComponentLink6URL: https://datasheet.ciiva.com/46399/1678782-46399980.pdf?src-supplier=Element14; ComponentLink6Description: https://datasheet.ciiva.com/46399/1678782-46399980.pdf?src-supplier=Element14; ComponentLink7URL: https://datasheet.ciiva.com/46399/1678782-46399981.pdf?src-supplier=Element14; ComponentLink7Description: https://datasheet.ciiva.com/46399/1678782-46399981.pdf?src-supplier=Element14; ComponentLink8URL: https://datasheet.ciiva.com/22776/1678782-22776542.pdf?src-supplier=Farnell; ComponentLink8Description: https://datasheet.ciiva.com/22776/1678782-22776542.pdf?src-supplier=Farnell; ComponentLink9URL: https://datasheet.ciiva.com/16774/70260748-16774815.pdf?src-supplier=Allied+Electronics; ComponentLink9Description: https://datasheet.ciiva.com/16774/70260748-16774815.pdf?src-supplier=Allied+Electronics
R34 = CMP-2002-00982-1: Manufacturer: Panasonic; Part Number: ERJ-2RKF5233X; Tolerance: 1%; Rated Power Dissipation (P): 100mW; Value: 523 kOhm; Temperature Coefficient: 100ppm/°C; Working Voltage: 50V; Rated Temperature: 70°C; Package Height: 0.35mm; Package Length: 1mm; Package Width: 0.5mm; Reference Standard: AEC-Q200; Supplier 1: Digi-Key; Supplier Part Number 1: P523KLCT-ND; Manufacturer Part Number: ERJ-2RKF5233X; RoHS: Yes; Category: Chip SMD Resistors; Stock 1: 154886; Pricing 1: 1=0.10000, 10=0.03300, 100=0.01330, 1000=0.00599, 2500=0.00520, 5000=0.00429 (USD); Mount: Surface Mount; Number of Pins: 2; Size Code: 0402; Terminal Finish: Nickel; Package Shape: Rectangular; Min Operating Temperature: -55°C; Max Operating Temperature: 155°C; JESD-609 Code: e3; Resistor Type: FIXED RESISTOR; Construction: Rectangular; Package Style: SMTMeter; Packaging: Tape and Reel; Technology: METAL GLAZE/THICK FILM; Termination: Wraparound; Reach SVHC Compliant: Yes; RoHS Compliant: Yes; ComponentLink1URL: https://datasheet.ciiva.com:443/pdfs/VipMasterIC/IC/PANA/PANA-S-A0009889626/PANA-S-A0009889626-1.pdf?src-supplier=IHS+Markit; ComponentLink1Description: https://datasheet.ciiva.com:443/pdfs/VipMasterIC/IC/PANA/PANA-S-A0009889626/PANA-S-A0009889626-1.pdf?src-supplier=IHS+Markit; ComponentLink2URL: https://datasheet.ciiva.com/30220/aoa0000ce2-30220984.pdf?src-supplier=Onlinecomponents.com; ComponentLink2Description: https://datasheet.ciiva.com/30220/aoa0000ce2-30220984.pdf?src-supplier=Onlinecomponents.com; ComponentLink3URL: https://datasheet.ciiva.com/24027/aoa0000ce2-24027141.pdf?src-supplier=Mouser; ComponentLink3Description: https://datasheet.ciiva.com/24027/aoa0000ce2-24027141.pdf?src-supplier=Mouser; ComponentLink4URL: https://datasheet.ciiva.com/9181/aoa0000ce2-9181337.pdf?src-supplier=Avnet; ComponentLink4Description: https://datasheet.ciiva.com/9181/aoa0000ce2-9181337.pdf?src-supplier=Avnet; ComponentLink5URL: https://datasheet.ciiva.com/9181/aoa0000ce2-9181340.pdf?src-supplier=Avnet; ComponentLink5Description: https://datasheet.ciiva.com/9181/aoa0000ce2-9181340.pdf?src-supplier=Avnet; ComponentLink6URL: https://datasheet.ciiva.com/22668/1678782-22668381.pdf?src-supplier=Element14; ComponentLink6Description: https://datasheet.ciiva.com/22668/1678782-22668381.pdf?src-supplier=Element14; ComponentLink7URL: https://datasheet.ciiva.com/43467/1678782-43467550.pdf?src-supplier=Farnell; ComponentLink7Description: https://datasheet.ciiva.com/43467/1678782-43467550.pdf?src-supplier=Farnell; ComponentLink8URL: https://datasheet.ciiva.com/46372/1678782-46372943.pdf?src-supplier=Element14; ComponentLink8Description: https://datasheet.ciiva.com/46372/1678782-46372943.pdf?src-supplier=Element14
R35 R37 = CMP-2002-01040-1: Manufacturer: Panasonic; Part Number: ERJ-2RKF6813X; Tolerance: 1%; Rated Power Dissipation (P): 100mW; Rated Temperature: 70°C; Value: 681 kOhm; Temperature Coefficient: 100ppm/°C; Working Voltage: 50V; Package Height: 0.35mm; Package Length: 1mm; Package Width: 0.5mm; Reference Standard: AEC-Q200; Supplier 1: Digi-Key; Supplier Part Number 1: P681KLCT-ND; Manufacturer Part Number: ERJ-2RKF6813X; RoHS: Yes; Category: Chip SMD Resistors; Stock 1: 3837; Pricing 1: 1=0.10000, 10=0.03300, 100=0.01330, 1000=0.00599, 2500=0.00520, 5000=0.00429 (USD); Mount: Surface Mount; Number of Pins: 2; Size Code: 0402; Terminal Finish: Nickel; Package Shape: Rectangular; Min Operating Temperature: -55°C; Max Operating Temperature: 155°C; Resistor Type: FIXED RESISTOR; Packaging: Tape and Reel; Termination: Wraparound; Construction: Rectangular; Package Style: SMTMeter; Technology: METAL GLAZE/THICK FILM; JESD-609 Code: e3; Reach SVHC Compliant: Yes; RoHS Compliant: Yes; ComponentLink1URL: https://datasheet.ciiva.com:443/pdfs/VipMasterIC/IC/PANA/PANA-S-A0009889626/PANA-S-A0009889626-1.pdf?src-supplier=IHS+Markit; ComponentLink1Description: https://datasheet.ciiva.com:443/pdfs/VipMasterIC/IC/PANA/PANA-S-A0009889626/PANA-S-A0009889626-1.pdf?src-supplier=IHS+Markit; ComponentLink2URL: https://datasheet.ciiva.com/3883/3984280s8821682n1386-3883650.pdf?src-supplier=Arrow+Electronics; ComponentLink2Description: https://datasheet.ciiva.com/3883/3984280s8821682n1386-3883650.pdf?src-supplier=Arrow+Electronics; ComponentLink3URL: https://datasheet.ciiva.com/16776/70260748-16776822.pdf?src-supplier=Allied+Electronics; ComponentLink3Description: https://datasheet.ciiva.com/16776/70260748-16776822.pdf?src-supplier=Allied+Electronics; ComponentLink4URL: https://datasheet.ciiva.com/9180/aoa0000ce2-9180392.pdf?src-supplier=Avnet; ComponentLink4Description: https://datasheet.ciiva.com/9180/aoa0000ce2-9180392.pdf?src-supplier=Avnet; ComponentLink5URL: https://datasheet.ciiva.com/22673/1678782-22673368.pdf?src-supplier=Element14; ComponentLink5Description: https://datasheet.ciiva.com/22673/1678782-22673368.pdf?src-supplier=Element14; ComponentLink6URL: https://datasheet.ciiva.com/7753/1678782-7753993.pdf?src-supplier=Element14; ComponentLink6Description: https://datasheet.ciiva.com/7753/1678782-7753993.pdf?src-supplier=Element14; ComponentLink7URL: https://datasheet.ciiva.com/16771/70260748-16771449.pdf?src-supplier=Allied+Electronics; ComponentLink7Description: https://datasheet.ciiva.com/16771/70260748-16771449.pdf?src-supplier=Allied+Electronics; ComponentLink8URL: https://datasheet.ciiva.com/9180/aoa0000ce2-9180348.pdf?src-supplier=Avnet; ComponentLink8Description: https://datasheet.ciiva.com/9180/aoa0000ce2-9180348.pdf?src-supplier=Avnet; ComponentLink9URL: https://datasheet.ciiva.com/43467/1678782-43467564.pdf?src-supplier=Farnell; ComponentLink9Description: https://datasheet.ciiva.com/43467/1678782-43467564.pdf?src-supplier=Farnell; ComponentLink10URL: https://datasheet.ciiva.com/24069/aoa0000ce2-24069822.pdf?src-supplier=Mouser; ComponentLink10Description: https://datasheet.ciiva.com/24069/aoa0000ce2-24069822.pdf?src-supplier=Mouser; ComponentLink11URL: https://datasheet.ciiva.com/46373/1678782-46373118.pdf?src-supplier=Element14; ComponentLink11Description: https://datasheet.ciiva.com/46373/1678782-46373118.pdf?src-supplier=Element14; ComponentLink12URL: https://datasheet.ciiva.com/30230/aoa0000ce2-30230479.pdf?src-supplier=Onlinecomponents.com; ComponentLink12Description: https://datasheet.ciiva.com/30230/aoa0000ce2-30230479.pdf?src-supplier=Onlinecomponents.com; ComponentLink13URL: https://datasheet.ciiva.com/46373/1678782-46373119.pdf?src-supplier=Element14; ComponentLink13Description: https://datasheet.ciiva.com/46373/1678782-46373119.pdf?src-supplier=Element14

## Sheet LED_String_NF2W757GT-F1.SchDoc: STB Light Board - 5000K String
size A4; Author: flmoll; DrawnBy: flmoll; Organization: PBL; Revision: A; SheetNumber: 8; SheetTotal: 20
Used 60 times, as channels LW1/W5_10, LW1/W5_11, LW1/W5_12, LW1/W5_13, LW1/W5_14, LW1/W5_20, LW1/W5_21, LW1/W5_22, LW1/W5_23, LW1/W5_24, LW1/W5_25, LW1/W5_30, LW1/W5_31, LW1/W5_32, LW1/W5_33, LW1/W5_34, LW1/W5_35, LW1/W5_40, LW1/W5_41, LW1/W5_42, LW1/W5_43, LW1/W5_44, LW1/W5_45, LW1/W5_50, LW1/W5_51, LW1/W5_52, LW1/W5_53, LW1/W5_54, LW1/W5_55, LW1/W5_60, LW1/W5_61, LW1/W5_62, LW1/W5_63, LW1/W5_64, LW1/W5_65, LW1/W5_70, LW1/W5_71, LW1/W5_72, LW1/W5_73, LW1/W5_74, LW1/W5_75, LW1/W5_80, LW1/W5_81, LW1/W5_82, LW1/W5_83, LW1/W5_84, LW1/W5_85, LW1/W5_90, LW1/W5_91, LW1/W5_92, LW1/W5_93, LW1/W5_94, LW1/W5_95, LW1/W5_A0, LW1/W5_A1, LW1/W5_A2, LW1/W5_A3, LW1/W5_A4, LW1/W5_A5, LW1/W5_15. Parts and nets are listed once, with the designators drawn on the sheet.
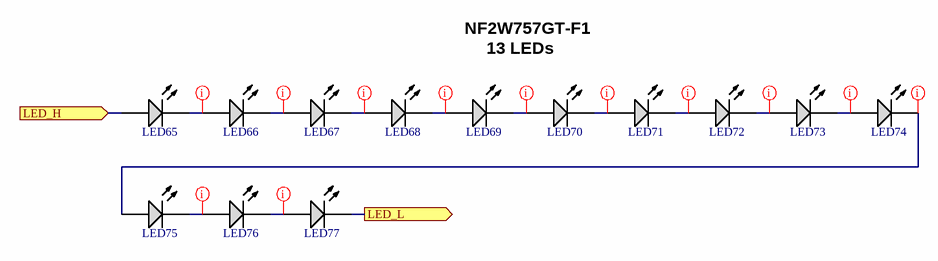
[diagram p15: LED_String_NF2W757GT-F1.SchDoc]

### Parts
LED65  NF2W757GT-F1  [NF2W757GT-F1]  (value not drawn)
LED66  NF2W757GT-F1  [NF2W757GT-F1]  (value not drawn)
LED67  NF2W757GT-F1  [NF2W757GT-F1]  (value not drawn)
LED68  NF2W757GT-F1  [NF2W757GT-F1]  (value not drawn)
LED69  NF2W757GT-F1  [NF2W757GT-F1]  (value not drawn)
LED70  NF2W757GT-F1  [NF2W757GT-F1]  (value not drawn)
LED71  NF2W757GT-F1  [NF2W757GT-F1]  (value not drawn)
LED72  NF2W757GT-F1  [NF2W757GT-F1]  (value not drawn)
LED73  NF2W757GT-F1  [NF2W757GT-F1]  (value not drawn)
LED74  NF2W757GT-F1  [NF2W757GT-F1]  (value not drawn)
LED75  NF2W757GT-F1  [NF2W757GT-F1]  (value not drawn)
LED76  NF2W757GT-F1  [NF2W757GT-F1]  (value not drawn)
LED77  NF2W757GT-F1  [NF2W757GT-F1]  (value not drawn)

### Ports
LED_H (in, see LED_Driver_NF2W757GT-F1[2A]), LED_L (out, see LED_Driver_NF2W757GT-F1[2A])

### Nets
LED_H: LED65.2(A) ; port LED_H
LED_L: LED77.1(K) ; port LED_L
NetLED65_1: LED65.1(K) LED66.2(A)
NetLED66_1: LED66.1(K) LED67.2(A)
NetLED67_1: LED67.1(K) LED68.2(A)
NetLED68_1: LED68.1(K) LED69.2(A)
NetLED69_1: LED69.1(K) LED70.2(A)
NetLED70_1: LED70.1(K) LED71.2(A)
NetLED71_1: LED71.1(K) LED72.2(A)
NetLED72_1: LED72.1(K) LED73.2(A)
NetLED73_1: LED73.1(K) LED74.2(A)
NetLED74_1: LED74.1(K) LED75.2(A)
NetLED75_1: LED75.1(K) LED76.2(A)
NetLED76_1: LED76.1(K) LED77.2(A)

### Channels
LW1/W5_10: designators end in _W5_10; ports LED_H=NetC7_D0_2 LED_L=NetLED77_W5_10_1
LW1/W5_11: designators end in _W5_11; ports LED_H=NetC7_D0_2 LED_L=NetLED77_W5_11_1
LW1/W5_12: designators end in _W5_12; ports LED_H=NetC7_D0_2 LED_L=NetLED77_W5_12_1
LW1/W5_13: designators end in _W5_13; ports LED_H=NetC7_D0_2 LED_L=NetLED77_W5_13_1
LW1/W5_14: designators end in _W5_14; ports LED_H=NetC7_D0_2 LED_L=NetLED77_W5_14_1
LW1/W5_20: designators end in _W5_20; ports LED_H=NetC7_D1_2 LED_L=NetLED77_W5_20_1
LW1/W5_21: designators end in _W5_21; ports LED_H=NetC7_D1_2 LED_L=NetLED77_W5_21_1
LW1/W5_22: designators end in _W5_22; ports LED_H=NetC7_D1_2 LED_L=NetLED77_W5_22_1
LW1/W5_23: designators end in _W5_23; ports LED_H=NetC7_D1_2 LED_L=NetLED77_W5_23_1
LW1/W5_24: designators end in _W5_24; ports LED_H=NetC7_D1_2 LED_L=NetLED77_W5_24_1
LW1/W5_25: designators end in _W5_25; ports LED_H=NetC7_D1_2 LED_L=NetLED77_W5_25_1
LW1/W5_30: designators end in _W5_30; ports LED_H=NetC7_D2_2 LED_L=NetLED77_W5_30_1
LW1/W5_31: designators end in _W5_31; ports LED_H=NetC7_D2_2 LED_L=NetLED77_W5_31_1
LW1/W5_32: designators end in _W5_32; ports LED_H=NetC7_D2_2 LED_L=NetLED77_W5_32_1
LW1/W5_33: designators end in _W5_33; ports LED_H=NetC7_D2_2 LED_L=NetLED77_W5_33_1
LW1/W5_34: designators end in _W5_34; ports LED_H=NetC7_D2_2 LED_L=NetLED77_W5_34_1
LW1/W5_35: designators end in _W5_35; ports LED_H=NetC7_D2_2 LED_L=NetLED77_W5_35_1
LW1/W5_40: designators end in _W5_40; ports LED_H=NetC7_D3_2 LED_L=NetLED77_W5_40_1
LW1/W5_41: designators end in _W5_41; ports LED_H=NetC7_D3_2 LED_L=NetLED77_W5_41_1
LW1/W5_42: designators end in _W5_42; ports LED_H=NetC7_D3_2 LED_L=NetLED77_W5_42_1
LW1/W5_43: designators end in _W5_43; ports LED_H=NetC7_D3_2 LED_L=NetLED77_W5_43_1
LW1/W5_44: designators end in _W5_44; ports LED_H=NetC7_D3_2 LED_L=NetLED77_W5_44_1
LW1/W5_45: designators end in _W5_45; ports LED_H=NetC7_D3_2 LED_L=NetLED77_W5_45_1
LW1/W5_50: designators end in _W5_50; ports LED_H=NetC7_D4_2 LED_L=NetLED77_W5_50_1
LW1/W5_51: designators end in _W5_51; ports LED_H=NetC7_D4_2 LED_L=NetLED77_W5_51_1
LW1/W5_52: designators end in _W5_52; ports LED_H=NetC7_D4_2 LED_L=NetLED77_W5_52_1
LW1/W5_53: designators end in _W5_53; ports LED_H=NetC7_D4_2 LED_L=NetLED77_W5_53_1
LW1/W5_54: designators end in _W5_54; ports LED_H=NetC7_D4_2 LED_L=NetLED77_W5_54_1
LW1/W5_55: designators end in _W5_55; ports LED_H=NetC7_D4_2 LED_L=NetLED77_W5_55_1
LW1/W5_60: designators end in _W5_60; ports LED_H=NetC7_D5_2 LED_L=NetLED77_W5_60_1
LW1/W5_61: designators end in _W5_61; ports LED_H=NetC7_D5_2 LED_L=NetLED77_W5_61_1
LW1/W5_62: designators end in _W5_62; ports LED_H=NetC7_D5_2 LED_L=NetLED77_W5_62_1
LW1/W5_63: designators end in _W5_63; ports LED_H=NetC7_D5_2 LED_L=NetLED77_W5_63_1
LW1/W5_64: designators end in _W5_64; ports LED_H=NetC7_D5_2 LED_L=NetLED77_W5_64_1
LW1/W5_65: designators end in _W5_65; ports LED_H=NetC7_D5_2 LED_L=NetLED77_W5_65_1
LW1/W5_70: designators end in _W5_70; ports LED_H=NetC7_D6_2 LED_L=NetLED77_W5_70_1
LW1/W5_71: designators end in _W5_71; ports LED_H=NetC7_D6_2 LED_L=NetLED77_W5_71_1
LW1/W5_72: designators end in _W5_72; ports LED_H=NetC7_D6_2 LED_L=NetLED77_W5_72_1
LW1/W5_73: designators end in _W5_73; ports LED_H=NetC7_D6_2 LED_L=NetLED77_W5_73_1
LW1/W5_74: designators end in _W5_74; ports LED_H=NetC7_D6_2 LED_L=NetLED77_W5_74_1
LW1/W5_75: designators end in _W5_75; ports LED_H=NetC7_D6_2 LED_L=NetLED77_W5_75_1
LW1/W5_80: designators end in _W5_80; ports LED_H=NetC7_D7_2 LED_L=NetLED77_W5_80_1
LW1/W5_81: designators end in _W5_81; ports LED_H=NetC7_D7_2 LED_L=NetLED77_W5_81_1
LW1/W5_82: designators end in _W5_82; ports LED_H=NetC7_D7_2 LED_L=NetLED77_W5_82_1
LW1/W5_83: designators end in _W5_83; ports LED_H=NetC7_D7_2 LED_L=NetLED77_W5_83_1
LW1/W5_84: designators end in _W5_84; ports LED_H=NetC7_D7_2 LED_L=NetLED77_W5_84_1
LW1/W5_85: designators end in _W5_85; ports LED_H=NetC7_D7_2 LED_L=NetLED77_W5_85_1
LW1/W5_90: designators end in _W5_90; ports LED_H=NetC7_D8_2 LED_L=NetLED77_W5_90_1
LW1/W5_91: designators end in _W5_91; ports LED_H=NetC7_D8_2 LED_L=NetLED77_W5_91_1
LW1/W5_92: designators end in _W5_92; ports LED_H=NetC7_D8_2 LED_L=NetLED77_W5_92_1
LW1/W5_93: designators end in _W5_93; ports LED_H=NetC7_D8_2 LED_L=NetLED77_W5_93_1
LW1/W5_94: designators end in _W5_94; ports LED_H=NetC7_D8_2 LED_L=NetLED77_W5_94_1
LW1/W5_95: designators end in _W5_95; ports LED_H=NetC7_D8_2 LED_L=NetLED77_W5_95_1
LW1/W5_A0: designators end in _W5_A0; ports LED_H=NetC7_D9_2 LED_L=NetLED77_W5_A0_1
LW1/W5_A1: designators end in _W5_A1; ports LED_H=NetC7_D9_2 LED_L=NetLED77_W5_A1_1
LW1/W5_A2: designators end in _W5_A2; ports LED_H=NetC7_D9_2 LED_L=NetLED77_W5_A2_1
LW1/W5_A3: designators end in _W5_A3; ports LED_H=NetC7_D9_2 LED_L=NetLED77_W5_A3_1
LW1/W5_A4: designators end in _W5_A4; ports LED_H=NetC7_D9_2 LED_L=NetLED77_W5_A4_1
LW1/W5_A5: designators end in _W5_A5; ports LED_H=NetC7_D9_2 LED_L=NetLED77_W5_A5_1
LW1/W5_15: designators end in _W5_15; ports LED_H=NetC7_D0_2 LED_L=NetLED77_W5_15_1

### Layout directives
net class LED: NetLED65_W5_10_1, NetLED66_W5_10_1, NetLED67_W5_10_1, NetLED68_W5_10_1, NetLED69_W5_10_1, NetLED70_W5_10_1, NetLED71_W5_10_1, NetLED72_W5_10_1, NetLED73_W5_10_1, NetLED74_W5_10_1, NetLED75_W5_10_1, NetLED76_W5_10_1

### Notes on the sheet
- NF2W757GT-F1
- 13 LEDs
- 1
- 2
- 3
- 4
- A
- B
- C
- Project:
- D
- Date:
- Drawing number:
- Rev:
- Format:
- A4 Q
- Drawn by:
- Laboratory:
- Page
- Sheet:
- of
- File:

### Library data of the parts
LED65-LED77 = CMP-02058-1: SMD LED White 3,3 V, 42,8 lm 3030 (1212); Manufacturer: Nichia; Optoelectronic Device Type: SINGLE COLOR LED; Vf: 3.3 V; Intensity: 42.8 lm; REACH SVHC: No SVHC; RoHS Compliant: Yes; Color: White; Manufacturer Part Number: NF2W757GT-F1